# EAGLE design BleuettePi (EAGLE 6.4)
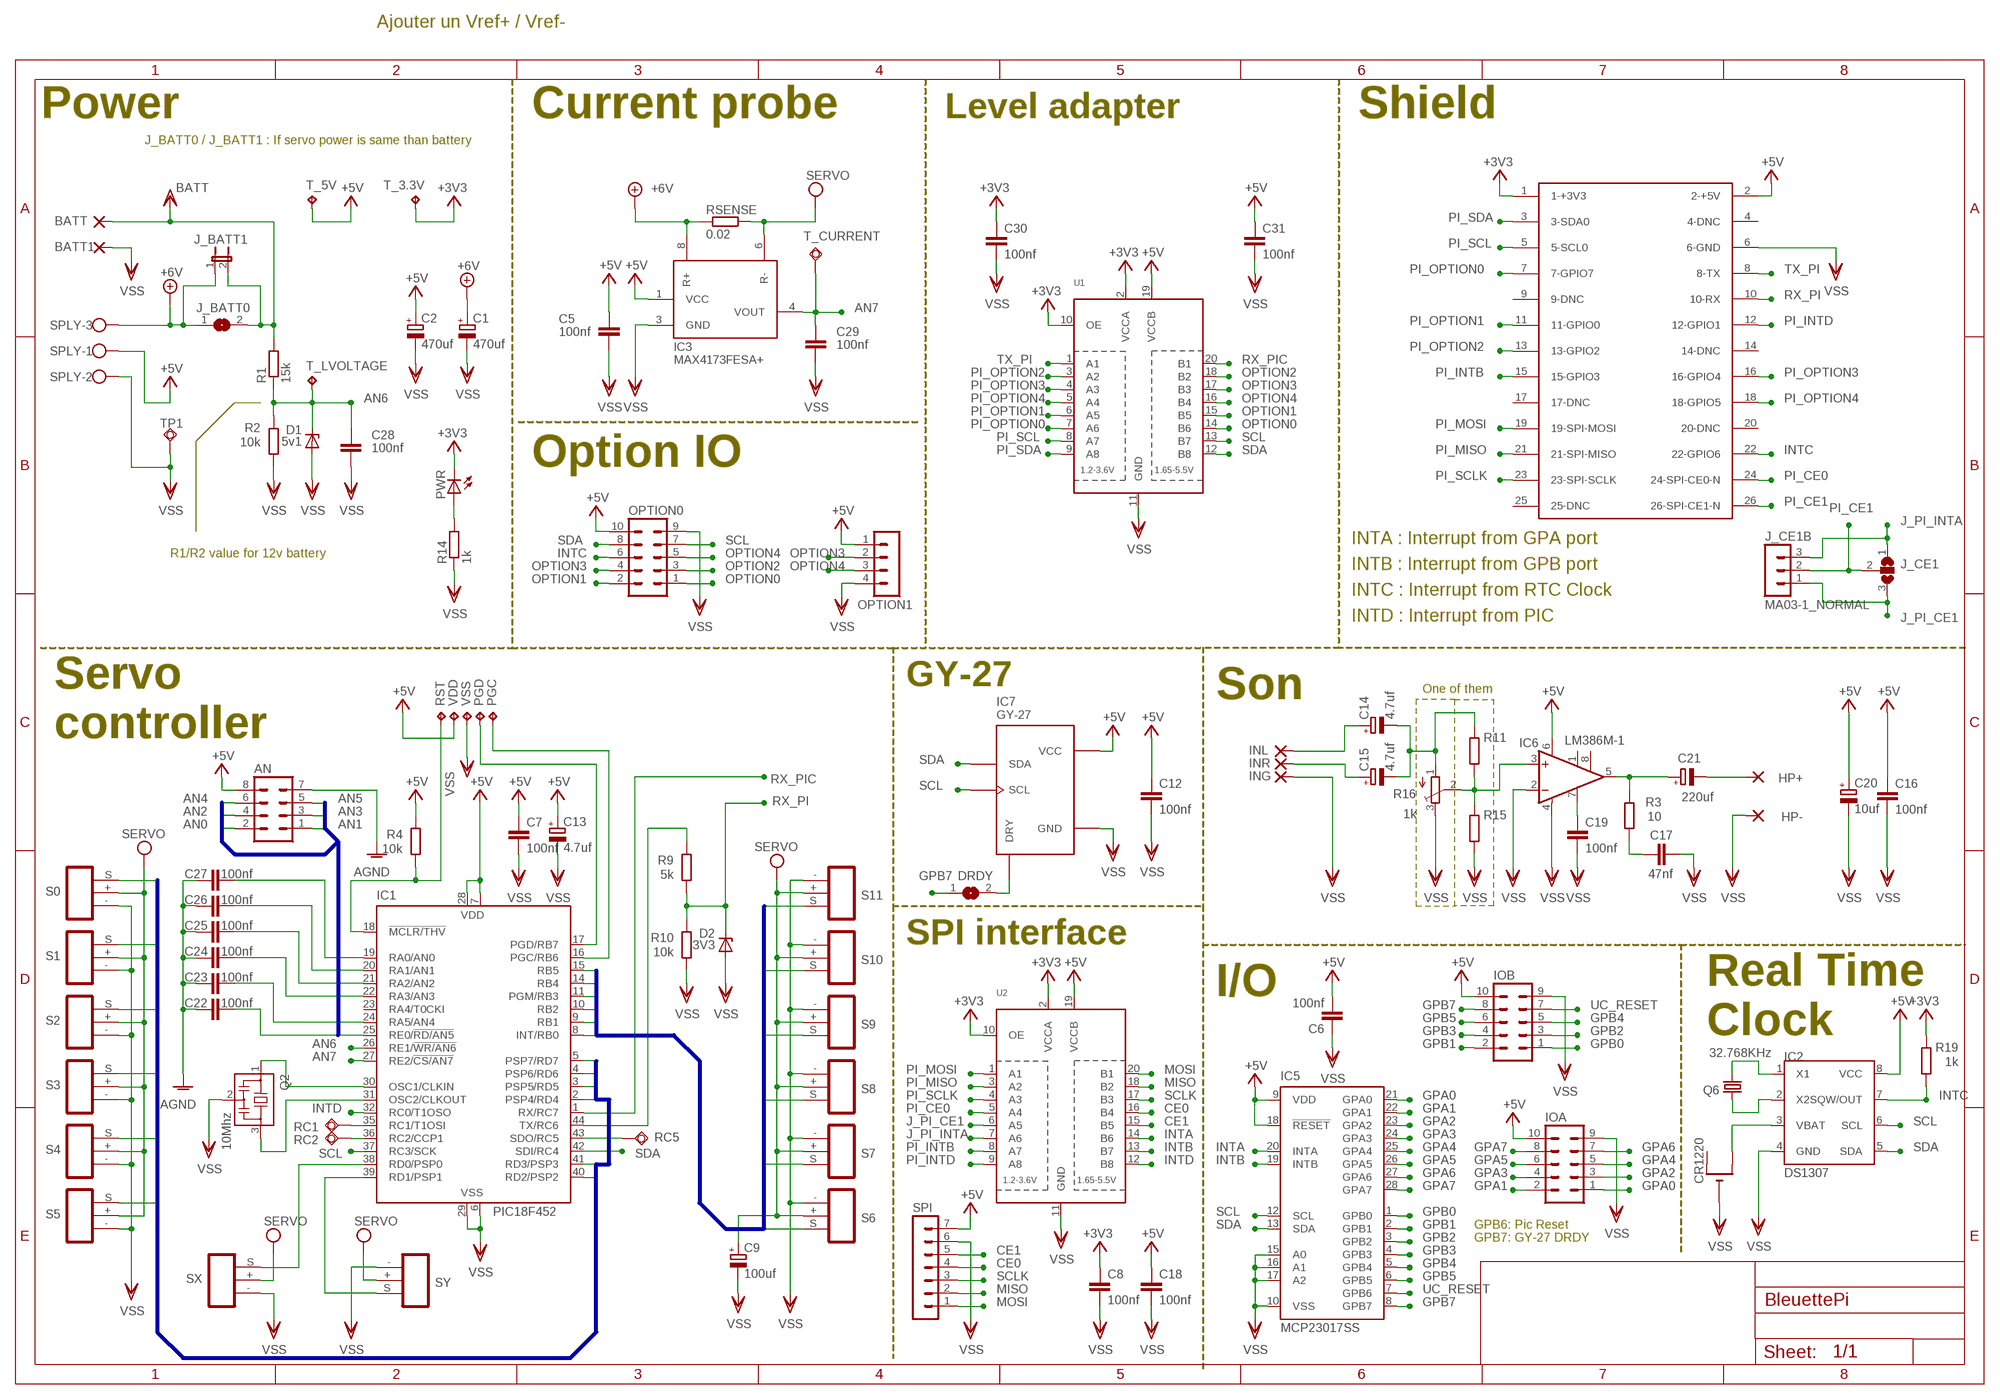
[diagram p0: schematic, sheet 1]

## Parts
AN  MA04-2  [MA04-2]
BATT  2,15/1,0  [2,15/1,0]
BATT1  2,15/1,0  [2,15/1,0]
C1  470uf  CPOL-EUF  [PANASONIC_F]
C2  470uf  CPOL-EUF  [PANASONIC_F]
C5  100nf  C-EUC0805  [C0805]
C6  100nf  C-EUC0805  [C0805]
C7  100nf  C-EUC0805  [C0805]
C8  100nf  C-EUC0805  [C0805]
C9  100uf  CPOL-EUD  [PANASONIC_D]
C12  100nf  C-EUC0805  [C0805]
C13  4.7uf  CPOL-EUCT3528  [CT3528]
C14  4.7uf  CPOL-EUCT3528  [CT3528]
C15  4.7uf  CPOL-EUCT3528  [CT3528]
C16  100nf  C-EUC0805  [C0805]
C17  47nf  C-EUC0805  [C0805]
C18  100nf  C-EUC0805  [C0805]
C19  100nf  C-EUC0805  [C0805]
C20  10uf  CPOL-EUCT3528  [CT3528]
C21  220uf  CPOL-EUD  [PANASONIC_D]
C22  100nf  C-EUC0805  [C0805]
C23  100nf  C-EUC0805  [C0805]
C24  100nf  C-EUC0805  [C0805]
C25  100nf  C-EUC0805  [C0805]
C26  100nf  C-EUC0805  [C0805]
C27  100nf  C-EUC0805  [C0805]
C28  100nf  C-EUC0805  [C0805]
C29  100nf  C-EUC0805  [C0805]
C30  100nf  C-EUC0805  [C0805]
C31  100nf  C-EUC0805  [C0805]
CR1220  CR1220THM  [CR1220-THM]
D1  5v1  ZENER-DIODESOT23  [SOT23]
D2  3V3  ZENER-DIODESOT23  [SOT23]
DRDY  SJ  [SJ]
HP+  2,15/1,0  [2,15/1,0]
HP-  2,15/1,0  [2,15/1,0]
IC1  PIC18F452  PIC16F877PT  [TQFP44]
IC2  DS1307  [SOIC-8]
IC3  MAX4173FESA+  MAX4173A  [SO08]
IC5  MCP23017SS  [SSOP28]
IC6  LM386M-1  [SO08]
IC7  GY-27  [GY-27]
ING  2,15/1,0  [2,15/1,0]
INL  2,15/1,0  [2,15/1,0]
INR  2,15/1,0  [2,15/1,0]
IOA  MA05-2  [MA05-2]
IOB  MA05-2  [MA05-2]
J_BATT0  SJ  [SJ]
J_BATT1  JP1E  [JP1]
J_CE1  SJ2W  [SJ_2]
J_CE1B  MA03-1_NORMAL  [MA03-1_NORMAL]
OPTION0  MA05-2  [MA05-2]
OPTION1  MA04-1  [MA04-1]
PGC  TPTP20R  [TP20R]
PGD  TPTP20R  [TP20R]
PWR  LEDCHIPLED_0805  [CHIPLED_0805]
Q2  10Mhz  CSTCR6M00G53Z  [CSTCR6M]
Q6  32.768KHz  CRYSTALTC26H  [TC26H]
R1  15k  R-EU_M0805  [M0805]
R2  10k  R-EU_M0805  [M0805]
R3  10  R-EU_M0805  [M0805]
R4  10k  R-EU_M0805  [M0805]
R9  5k  R-EU_M0805  [M0805]
R10  10k  R-EU_M0805  [M0805]
R11  R-EU_M0805  [M0805]
R14  1k  R-EU_M0805  [M0805]
R15  R-EU_M0805  [M0805]
R16  1k  TRIM_EU-3223J  [3223J]
R19  1k  R-EU_M0805  [M0805]
RC1  TPSQTP06SQ  [TP06SQ]
RC2  TPSQTP06SQ  [TP06SQ]
RC5  TPSQTP06SQ  [TP06SQ]
RSENSE  0.02  R-EU_R4527  [R4527]
RST  TPTP20R  [TP20R]
S0  CONN_SERVO  [CONN_SERVO]
S1  CONN_SERVO  [CONN_SERVO]
S2  CONN_SERVO  [CONN_SERVO]
S3  CONN_SERVO  [CONN_SERVO]
S4  CONN_SERVO  [CONN_SERVO]
S5  CONN_SERVO  [CONN_SERVO]
S6  CONN_SERVO  [CONN_SERVO]
S7  CONN_SERVO  [CONN_SERVO]
S8  CONN_SERVO  [CONN_SERVO]
S9  CONN_SERVO  [CONN_SERVO]
S10  CONN_SERVO  [CONN_SERVO]
S11  CONN_SERVO  [CONN_SERVO]
SPI  MA07-1  [MA07-1]
SPLY  W237-103  [W237-103]
SX  CONN_SERVO  [CONN_SERVO]
SY  CONN_SERVO  [CONN_SERVO]
T_3.3V  TPB1,27  [B1,27]
T_5V  TPB1,27  [B1,27]
T_CURRENT  TPSQPAD1-13  [P1-13]
T_LVOLTAGE  TPB1,27  [B1,27]
TP1  TPSQPAD1-13  [P1-13]
U1  TXB0108PWR  [TSSOP20]
U2  TXB0108PWR  [TSSOP20]
U$3  RASPBERRY-PILIGHT-HOLE  [RASPBERRY-PI-LIGHT-HOLE]
VDD  TPTP20R  [TP20R]
VSS  TPTP20R  [TP20R]

## Nets
+3V3: C8.1 C30.1 PWR.C R19.2 T_3.3V.TP U1.2(VCCA) U1.10(OE) U2.2(VCCA) U2.10(OE) U$3.1(1-+3V3)
+5V: AN.8 C2.+ C5.1 C6.2 C7.1 C12.1 C13.+ C16.1 C18.1 C20.+ C31.1 IC1.7(VDD) IC1.28(VDD) IC2.8(VCC) IC3.1(VCC) IC5.9(VDD) IC5.18(!RESET) IC6.6(VS) IC7.VCC IOA.10 IOB.10 OPTION0.10 OPTION1.1 R4.2 SPI.7 SPLY.1 T_5V.TP U1.19(VCCB) U2.19(VCCB) U$3.2(2-+5V) VDD.TP
+7V: C1.+ IC3.8(R+) J_BATT0.1 J_BATT1.1 RSENSE.1 SPLY.3 ; supply symbol labelled +6V
AGND: AN.7 C22.1 C23.1 C24.1 C25.1 C26.1 C27.1
AN0: AN.2 C27.2 IC1.19(RA0/AN0)
AN1: AN.1 C26.2 IC1.20(RA1/AN1)
AN2: AN.4 C25.2 IC1.21(RA2/AN2)
AN3: AN.3 C24.2 IC1.22(RA3/AN3)
AN4: AN.6 C23.2 IC1.24(RA5/AN4)
AN5: AN.5 C22.2 IC1.25(RE0/!RD/AN5)
AN6: C28.2 D1.3(C) IC1.26(RE1/!WR/AN6) R1.1 R2.2 T_LVOLTAGE.TP
AN7: C29.2 IC1.27(RE2/!CS/AN7) IC3.4(VOUT) T_CURRENT.TP
CE0: SPI.4 U2.16(B4)
CE1: SPI.5 U2.15(B5)
GPA0: IC5.21(GPA0) IOA.1
GPA1: IC5.22(GPA1) IOA.2
GPA2: IC5.23(GPA2) IOA.3
GPA3: IC5.24(GPA3) IOA.4
GPA4: IC5.25(GPA4) IOA.5
GPA5: IC5.26(GPA5) IOA.6
GPA6: IC5.27(GPA6) IOA.7
GPA7: IC5.28(GPA7) IOA.8
GPB0: IC5.1(GPB0) IOB.1
GPB1: IC5.2(GPB1) IOB.2
GPB2: IC5.3(GPB2) IOB.3
GPB3: IC5.4(GPB3) IOB.4
GPB4: IC5.5(GPB4) IOB.5
GPB5: IC5.6(GPB5) IOB.6
GPB7: DRDY.1 IC5.8(GPB7) IOB.8
INTA: IC5.20(INTA) U2.14(B6)
INTB: IC5.19(INTB) U2.13(B7)
INTC: IC2.7(SQW/OUT) OPTION0.6 R19.1 U$3.22(22-GPIO6)
INTD: IC1.32(RC0/T1OSO) U2.12(B8)
J_PI_CE1: J_CE1.3 J_CE1B.1 U2.6(A5)
J_PI_INTA: J_CE1.1 J_CE1B.3 U2.7(A6)
MISO: SPI.2 U2.18(B2)
MOSI: SPI.1 U2.20(B1)
N$1: IC1.31(OSC2/CLKOUT) Q2.3
N$2: IC1.30(OSC1/CLKIN) Q2.1
N$7: C14.- C15.- R11.2 R16.1(A)
N$8: C14.+ INL.1(P)
N$9: C21.- HP+.1(P)
N$19: IC1.38(RD0/PSP0) SX.S
N$22: IC1.17(PGD/RB7) PGD.TP
N$23: IC1.16(PGC/RB6) PGC.TP
N$24: IC1.39(RD1/PSP1) SY.S
N$33: IC2.1(X1) Q6.2
N$34: IC2.2(X2) Q6.1
N$36: DRDY.2 IC7.DRY
N$39: PWR.A R14.2
N$40: C15.+ INR.1(P)
N$41: IC6.3(+IN) R11.1 R15.2 R16.2(S)
N$42: C21.+ IC6.5(OUT) R3.2
N$43: C17.1 R3.1
N$47: C19.1 IC6.7(BYPASS)
N$58: CR1220.+2(+1) IC2.3(VBAT)
OPTION0: OPTION0.1 U1.14(B6)
OPTION1: OPTION0.2 U1.15(B5)
OPTION2: OPTION0.3 U1.18(B2)
OPTION3: OPTION0.4 OPTION1.2 U1.17(B3)
OPTION4: OPTION0.5 OPTION1.3 U1.16(B4)
PI_CE0: U2.5(A4) U$3.24(24-SPI-CE0-N)
PI_CE1: J_CE1.2 J_CE1B.2 U$3.26(26-SPI-CE1-N)
PI_INTB: U2.8(A7) U$3.15(15-GPIO3)
PI_INTD: U2.9(A8) U$3.12(12-GPIO1)
PI_MISO: U2.3(A2) U$3.21(21-SPI-MISO)
PI_MOSI: U2.1(A1) U$3.19(19-SPI-MOSI)
PI_OPTION0: U1.7(A6) U$3.7(7-GPIO7)
PI_OPTION1: U1.6(A5) U$3.11(11-GPIO0)
PI_OPTION2: U1.3(A2) U$3.13(13-GPIO2)
PI_OPTION3: U1.4(A3) U$3.16(16-GPIO4)
PI_OPTION4: U1.5(A4) U$3.18(18-GPIO5)
PI_SCL: U1.8(A7) U$3.5(5-SCL0)
PI_SCLK: U2.4(A3) U$3.23(23-SPI-SCLK)
PI_SDA: U1.9(A8) U$3.3(3-SDA0)
RC1: IC1.35(RC1/T1OSI) RC1.TP
RC2: IC1.36(RC2/CCP1) RC2.TP
RC5: IC1.43(SDO/RC5) RC5.TP
RX_PI: D2.3(C) R9.1 R10.2 U$3.10(10-RX)
RX_PIC: IC1.1(RX/RC7) U1.20(B1)
SCL: IC1.37(RC3/SCK) IC2.6(SCL) IC5.12(SCL) IC7.SCL OPTION0.7 U1.13(B7)
SCLK: SPI.3 U2.17(B3)
SDA: IC1.42(SDI/RC4) IC2.5(SDA) IC5.13(SDA) IC7.SDA OPTION0.8 U1.12(B8)
SS0: IC1.40(RD2/PSP2) S0.S
SS1: IC1.41(RD3/PSP3) S1.S
SS2: IC1.2(PSP4/RD4) S2.S
SS3: IC1.3(PSP5/RD5) S3.S
SS4: IC1.4(PSP6/RD6) S4.S
SS5: IC1.5(PSP7/RD7) S5.S
SS6: IC1.8(INT/RB0) S6.S
SS7: IC1.9(RB1) S7.S
SS8: IC1.10(RB2) S8.S
SS9: IC1.11(PGM/RB3) S9.S
SS10: IC1.14(RB4) S10.S
SS11: IC1.15(RB5) S11.S
TX_PI: U1.1(A1) U$3.8(8-TX)
TX_PIC: IC1.44(TX/RC6) R9.2
UC_RESET: IC1.18(!MCLR/THV) IC5.7(GPB6) IOB.7 R4.1 RST.TP
VDD: BATT.1(P) J_BATT0.2 J_BATT1.2 R1.2 ; supply symbol labelled BATT
VEE: C9.+ IC3.6(R-) RSENSE.2 S0.+ S1.+ S2.+ S3.+ S4.+ S5.+ S6.+ S7.+ S8.+ S9.+ S10.+ S11.+ SX.+ SY.+ ; supply symbol labelled SERVO
VSS: BATT1.1(P) C1.- C2.- C5.2 C6.1 C7.2 C8.2 C9.- C12.2 C13.- C16.2 C17.2 C18.2 C19.2 C20.- C28.1 C29.1 C30.2 C31.2 CR1220.- D1.1(A) D2.1(A) HP-.1(P) IC1.6(VSS) IC1.29(VSS) IC2.4(GND) IC3.3(GND) IC5.10(VSS) IC5.15(A0) IC5.16(A1) IC5.17(A2) IC6.2(-IN) IC6.4(GND) IC7.GND ING.1(P) IOA.9 IOB.9 OPTION0.9 OPTION1.4 Q2.2 R2.1 R10.1 R14.1 R15.1 R16.3(E) S0.- S1.- S2.- S3.- S4.- S5.- S6.- S7.- S8.- S9.- S10.- S11.- SPI.6 SPLY.2 SX.- SY.- TP1.TP U1.11(GND) U2.11(GND) U$3.6(6-GND) VSS.TP
Unconnected: CR1220.+1(+) IC1.23(RA4/T0CKI) IC6.1(GAIN) IC6.8(GAIN) U$3.4(4-DNC) U$3.9(9-DNC) U$3.14(14-DNC) U$3.17(17-DNC) U$3.20(20-DNC) U$3.25(25-DNC)

## Buses
SS[0..5]
SS[6..11]
AN[0..5]

## Notes on the sheet
- Ajouter un Vref+ / Vref-
- Power | Current probe | Level adapter | Shield
- J_BATT0 / J_BATT1 : If servo power is same than battery
- Option IO
- INTA : Interrupt from GPA port
- R1/R2 value for 12v battery
- INTB : Interrupt from GPB port
- INTC : Interrupt from RTC Clock
- INTD : Interrupt from PIC
- GY-27
- One of them
- Son
- Servo
  controller
- SPI interface
- I/O
- Real Time
  Clock
- GPB6: Pic Reset
- GPB7: GY-27 DRDY

## Library data of the parts
AN = con-lstb:MA04-2: PIN HEADER; OC_FARNELL: unknown; OC_NEWARK: unknown
BATT BATT1 HP+ HP- ING INL INR = wirepad:2,15/1,0: THROUGH-HOLE PAD
C1 C2 C9 C13-C15 C20 C21 = rcl:CPOL-EU: POLARIZED CAPACITOR, European symbol
C5-C8 C12 C16-C19 C22-C31 = rcl:C-EU: CAPACITOR, European symbol
CR1220 = adafruit:CR1220: CR1216/CR1220/CR1225 12mm 3V lithium coin cell Great for battery packup. Both SMT and THM holders. Note the THM package has the ground pads on both sides of the PCB so that the masks are the same - this reduces the cost
D1 D2 = diode:ZENER-DIODE: Z-Diode
DRDY J_BATT0 = jumper:SJ: SMD solder JUMPER
IC1 = microchip:PIC16F87*: MICROCONTROLLER; MF: MICROCHIP; MPN: PIC16F877-04/PQ; OC_FARNELL: 9761411; OC_NEWARK: 23C5094
IC2 = eagleParts:DS1307: I2C Serial RTC w/56 bytes battery backed RAM
IC3 = AWJLEagleLib:MAX4173: Maxim MAX4173 high side current monitor SOT363 pin 2 goes to GND
IC5 = adafruit:MCP23017: http://ww1.microchip.com/downloads/en/DeviceDoc/21952a.pdf Source: http://ww1.microchip.com/downloads/en/DeviceDoc/21952a.pdf
IC6 = linear:LM386?-*: Low Voltage Audio Power Amplifier Source: http://cache.national.com/ds/LM/LM386.pdf
IC7 = gy-27:GY-27
IOA IOB OPTION0 = con-lstb:MA05-2: PIN HEADER; OC_FARNELL: unknown; OC_NEWARK: unknown
J_BATT1 = jumper:JP1E: JUMPER
J_CE1 = jumper:SJ2W: SMD solder JUMPER
J_CE1B = con-lstb:MA03-1_NORMAL
OPTION1 = con-lstb:MA04-1: PIN HEADER; OC_FARNELL: unknown; OC_NEWARK: unknown
PGC PGD RST T_3.3V T_5V T_LVOLTAGE VDD VSS = testpad:TP: Test pad
PWR = led:LED: LED OSRAM: - CHIPLED LG R971, LG N971, LY N971, LG Q971, LY Q971, LO R971, LY R971 LH N974, LH R974 LS Q976, LO Q976, LY Q976 LO Q996 - Hyper CHIPLED LW Q18S LB Q993, LB Q99A, LB R99A - SideLED LS A670, LO A670, LY A670, LG A670, LP A670 LB A673, LV A673, LT A673, LW A673 LH A674 LY A675 LS A676, LA A676, LO A676, LY A676, LW A676 LS A679, LY A679, LG A679 - Hyper Micro SIDELED® LS Y876, LA Y876, LO Y876, LY Y876 LT Y87S - SmartLED LW L88C, LW L88S LB L89C, LB L89S, LG L890 LS L89K, LO L89K, LY L89K LS L896, LA L896, LO L896, LY L896 - TOPLED LS T670, LO T670, LY T670, LG T670, LP T670 LSG T670, LSP T670, LSY T670, LOP T670, LYG T670 LG T671, LOG T671, LSG T671 LB T673, LV T673, LT T673, LW T673 LH T674 LS T676, LA T676, LO T676, LY T676, LB T676, LH T676, LSB T676, LW T676 LB T67C, LV T67C, LT T67C, LS T67K, LO T67K, LY T67K, LW E67C LS E67B, LA E67B, LO E67B, LY E67B, LB E67C, LV E67C, LT E67C LW T67C LS T679, LY T679, LG T679 LS T770, LO T770, LY T770, LG T770, LP T770 LB T773, LV T773, LT T773, LW T773 LH T774 LS E675, LA E675, LY E675, LS T675 LS T776, LA T776, LO T776, LY T776, LB T776 LHGB T686 LT T68C, LB T68C - Hyper Mini TOPLED® LB M676 - Mini TOPLED Santana® LG M470 LS M47K, LO M47K, LY M47K Source: http://www.osram.convergy.de LUXEON: - LUMILED® LXK2-PW12-R00, LXK2-PW12-S00, LXK2-PW14-U00, LXK2-PW14-V00 LXK2-PM12-R00, LXK2-PM12-S00, LXK2-PM14-U00 LXK2-PE12-Q00, LXK2-PE12-R00, LXK2-PE12-S00, LXK2-PE14-T00, LXK2-PE14-U00 LXK2-PB12-K00, LXK2-PB12-L00, LXK2-PB12-M00, LXK2-PB14-N00, LXK2-PB14-P00, LXK2-PB14-Q00 LXK2-PR12-L00, LXK2-PR12-M00, LXK2-PR14-Q00, LXK2-PR14-R00 LXK2-PD12-Q00, LXK2-PD12-R00, LXK2-PD12-S00 LXK2-PH12-R00, LXK2-PH12-S00 LXK2-PL12-P00, LXK2-PL12-Q00, LXK2-PL12-R00 Source: www.luxeon.com KINGBRIGHT: KA-3528ASYC Source: www.kingbright.com
Q2 = murata-filter:CSTCR: Resonator Source: murata.co.jp; MPN: CSTCR6M00G53-R0; OC_FARNELL: 1170434; OC_NEWARK: 25M8759
Q6 = crystal:CRYSTAL: CRYSTAL; OC_FARNELL: unknown; OC_NEWARK: unknown
R1-R4 R9-R11 R14 R15 R19 RSENSE = rcl:R-EU_: RESISTOR, European symbol
R16 = pot:TRIM_EU-: POTENTIOMETER
RC1 RC2 RC5 T_CURRENT TP1 = testpad:TPSQ: Test pad
S0 S1-S11 SX SY = bleuette:CONN_SERVO
SPI = con-lstb:MA07-1: PIN HEADER; OC_FARNELL: unknown; OC_NEWARK: unknown
SPLY = con-wago-500:W237-103: WAGO SCREW CLAMP; MPN: 237-103; OC_FARNELL: unknown; OC_NEWARK: 18M7116
U1 U2 = adafruit:TXB0108PWR: 8-Bit Bi-Directional Level Shifter 1.2V-3.6V (VCCA) to 1.65V-5.5V (VCCB) bi-directional level shifter with auto direction sensing. Max data rate - VCCA 1.8V: 20Mbps (50ns), VCCA 3.3V: 100Mbps (10ns) Digikey: 296-21527-1-ND
U$3 = RaspberryPi:RASPBERRY-PI: Raspberry Pi Board <http://www.raspberrypi.org/> Jacques Lagnel V1.0 (beta) 2012 Board dimension: Forum 3D model <http://www.raspberrypi.org/forum/general-discussion/mechanical-profile-3d-models?value=3d%20model&type=1&include=1&search=1&ret=all> The GPIO Connector (P1): http://elinux.org/RPi_Low-level_peripherals

## Board
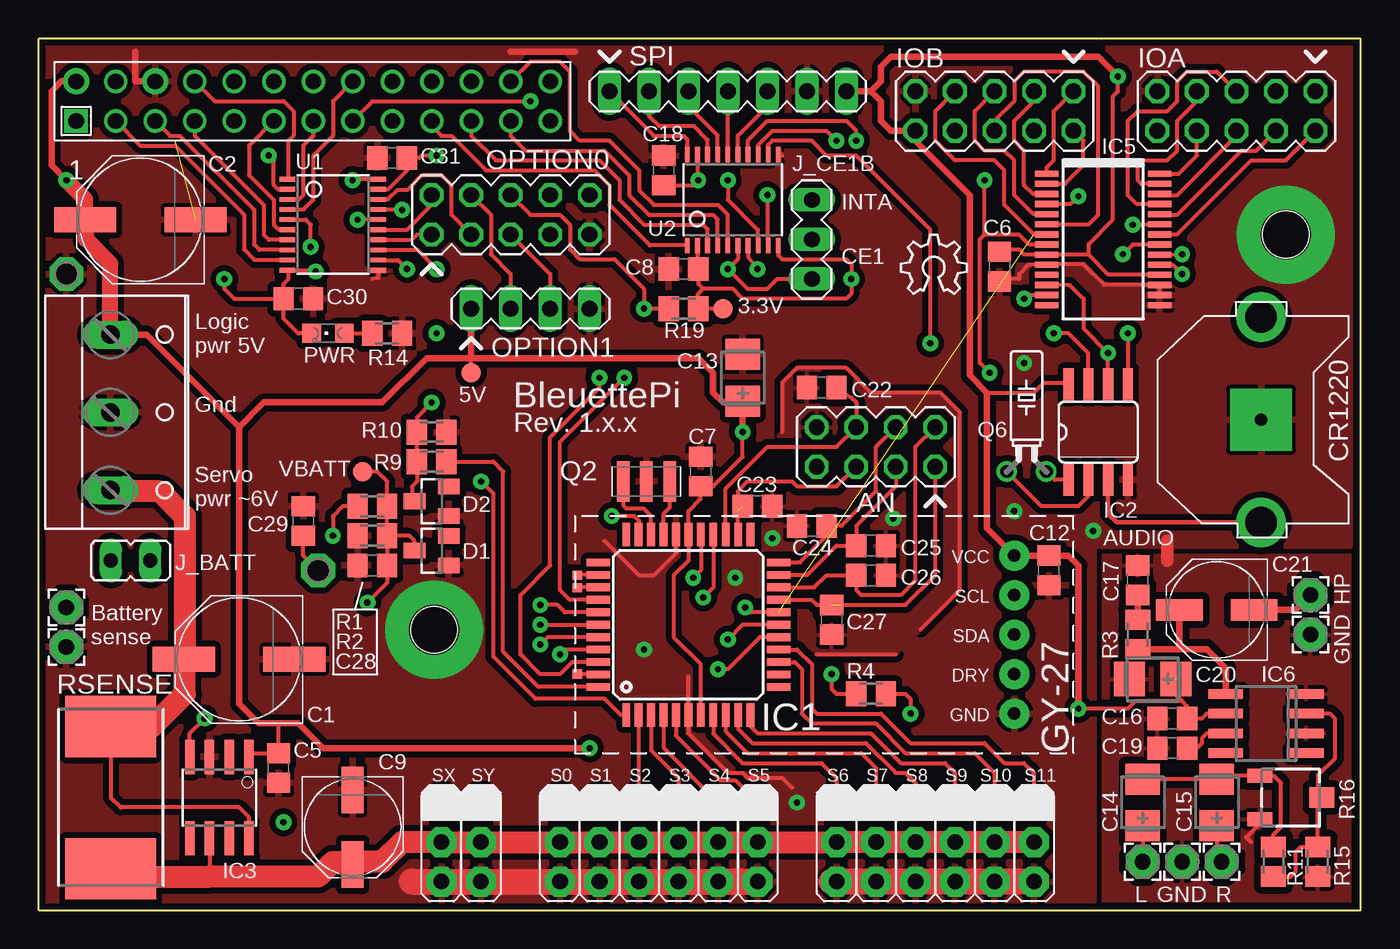
[diagram p1: board, top side]
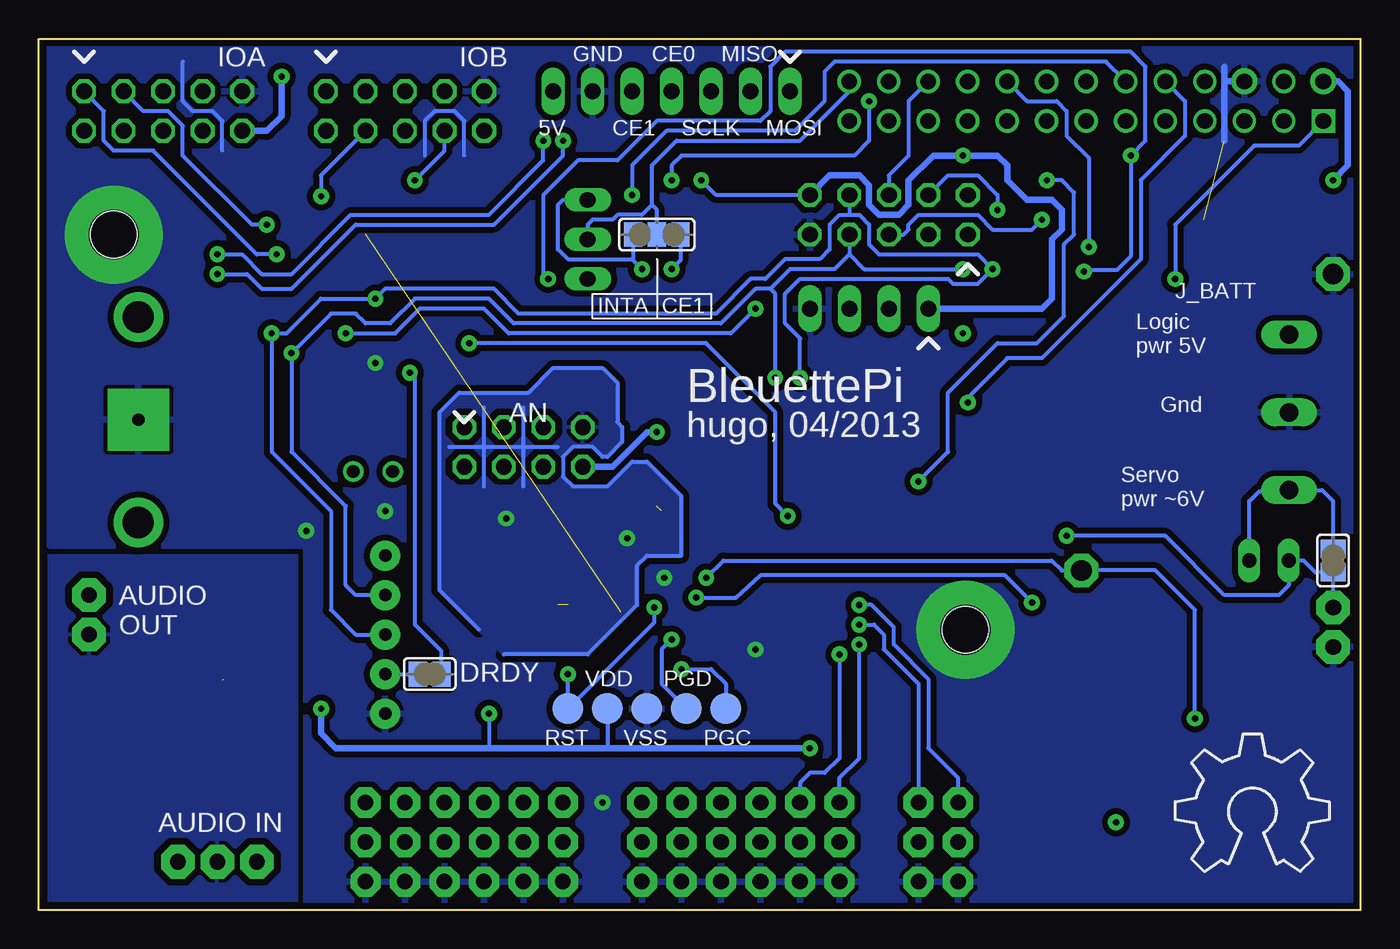
[diagram p2: board, bottom side, seen from below]

Size 85 x 56 mm. Coordinates in mm from the lower left corner, seen from the top.
Copper layers (1*16): Top 0.035mm / dielectric 1.5mm / Bottom 0.035mm
Design rules "Fusion_eagle_rule_v1.1": minimum track width 6mil, minimum drill 12mil, track to track 6mil, track to pad 6mil, pad to pad 6mil, via to via 6mil, smd to smd 0mil, copper to edge 10mil, drill to drill 10mil, minimum pad ring 10mil, minimum via ring 6mil, stop-mask expansion 2mil, vias tented up to drill 100mil, thermal gap 10mil

### Footprints (pad centres in the part's own frame; a part is rotated, then mirrored left to right if it is on the bottom)
MA04-2 = drill 1.016 octagon: 1 -3.81,-1.27; 2 -3.81,1.27; 3 -1.27,-1.27; 4 -1.27,1.27; 5 1.27,-1.27; 6 1.27,1.27; 7 3.81,-1.27; 8 3.81,1.27
2,15/1,0 = drill 1.016 pad 2.159 octagon: 1 0,0
PANASONIC_F = smd 4 x 1.6: + 3.55,0; - -3.55,0
C0805 = smd 1.3 x 1.5: 1 -0.95,0; 2 0.95,0
PANASONIC_D = smd 3 x 1.4: + 2.4,0; - -2.4,0
CT3528 = smd 2 x 2.2: + -1.5,0; - 1.5,0
CR1220-THM = drill 2 pad 3.175: +1 -6.604,0; +2 6.604,0 | drill 0.8 pad 3.962 square: - 0,0
SOT23 = smd 1 x 1.4: 1 -0.95,-1.1; 2 0.95,-1.1; 3 0,1.1
SJ = smd 1.168 x 1.6: 1 -0.762,0; 2 0.762,0
TQFP44 = smd 1.5 x 0.5: 1 -5.8,4; 2 -5.8,3.2; 3 -5.8,2.4; 4 -5.8,1.6; 5 -5.8,0.8; 6 -5.8,0; 7 -5.8,-0.8; 8 -5.8,-1.6; 9 -5.8,-2.4; 10 -5.8,-3.2; 11 -5.8,-4; 23 5.8,-4; 24 5.8,-3.2; 25 5.8,-2.4; 26 5.8,-1.6; 27 5.8,-0.8; 28 5.8,0; 29 5.8,0.8; 30 5.8,1.6; 31 5.8,2.4; 32 5.8,3.2; 33 5.8,4 | smd 0.5 x 1.5: 12 -4,-5.8; 13 -3.2,-5.8; 14 -2.4,-5.8; 15 -1.6,-5.8; 16 -0.8,-5.8; 17 0,-5.8; 18 0.8,-5.8; 19 1.6,-5.8; 20 2.4,-5.8; 21 3.2,-5.8; 22 4,-5.8; 34 4,5.8; 35 3.2,5.8; 36 2.4,5.8; 37 1.6,5.8; 38 0.8,5.8; 39 0,5.8; 40 -0.8,5.8; 41 -1.6,5.8; 42 -2.4,5.8; 43 -3.2,5.8; 44 -4,5.8
SOIC-8 = smd 2.032 x 0.66: 1 -3.073,1.27; 2 -3.073,0; 3 -3.073,-1.27; 4 -3.073,-2.54; 5 3.073,-2.54; 6 3.073,-1.27; 7 3.073,0; 8 3.073,1.27
SO08 = smd 0.61 x 2.21: 1 -1.905,-2.616; 2 -0.635,-2.616; 3 0.635,-2.616; 4 1.905,-2.616; 5 1.905,2.616; 6 0.635,2.616; 7 -0.635,2.616; 8 -1.905,2.616
SSOP28 = smd 0.4 x 1.5: 1 -4.225,-3.625; 2 -3.575,-3.625; 3 -2.925,-3.625; 4 -2.275,-3.625; 5 -1.625,-3.625; 6 -0.975,-3.625; 7 -0.325,-3.625; 8 0.325,-3.625; 9 0.975,-3.625; 10 1.625,-3.625; 11 2.275,-3.625; 12 2.925,-3.625; 13 3.575,-3.625; 14 4.225,-3.625; 15 4.225,3.625; 16 3.575,3.625; 17 2.925,3.625; 18 2.275,3.625; 19 1.625,3.625; 20 0.975,3.625; 21 0.325,3.625; 22 -0.325,3.625; 23 -0.975,3.625; 24 -1.625,3.625; 25 -2.275,3.625; 26 -2.925,3.625; 27 -3.575,3.625; 28 -4.225,3.625
SO08' = smd 0.6 x 2.2: 1 -1.905,-2.6; 2 -0.635,-2.6; 3 0.635,-2.6; 4 1.905,-2.6; 5 1.905,2.6; 6 0.635,2.6; 7 -0.635,2.6; 8 -1.905,2.6
GY-27 = drill 0.8 pad 1.93: DRY 3.81,10.16; GND 3.81,12.7; SCL 3.81,5.08; SDA 3.81,7.62; VCC 3.81,2.54
MA05-2 = drill 1.016 octagon: 1 -5.08,-1.27; 2 -5.08,1.27; 3 -2.54,-1.27; 4 -2.54,1.27; 5 0,-1.27; 6 0,1.27; 7 2.54,-1.27; 8 2.54,1.27; 9 5.08,-1.27; 10 5.08,1.27
JP1 = drill 0.914 long: 1 0,-1.27; 2 0,1.27
SJ_2 = smd 1.168 x 1.6: 1 -1.524,0; 2 0,0; 3 1.524,0
MA03-1_NORMAL = drill 1.016 long: 1 -3.81,0; 2 -1.27,0; 3 1.27,0
MA04-1 = drill 1.016 long: 1 -3.81,0; 2 -1.27,0; 3 1.27,0; 4 3.81,0
TP20R = smd 2 x 2: TP 0,0
CHIPLED_0805 = smd 1.2 x 1.2: A 0,-1.05; C 0,1.05
CSTCR6M = smd 0.8 x 2.6: 1 -1.5,0; 2 0,0; 3 1.5,0
TC26H = drill 0.813: 1 -1.27,0; 2 1.27,0
M0805 = smd 1.3 x 1.6: 1 -0.95,0; 2 0.95,0
3223J = smd 1.6 x 0.9: 1 -2,1.4; 3 -2,-1.4 | smd 1.6 x 1.3: 2 2,0
TP06SQ = smd 0.6 x 0.6: TP 0,0
R4527 = smd 3.94 x 5.84: 1 -4.575,0; 2 4.575,0
CONN_SERVO = drill 1 pad 1.93 octagon: + 0,0; - 2.54,0; S -2.54,0
MA07-1 = drill 1.016 long: 1 -7.62,0; 2 -5.08,0; 3 -2.54,0; 4 0,0; 5 2.54,0; 6 5.08,0; 7 7.62,0
W237-103 = drill 1.194 long: 1 -5,-1.29; 2 0,-1.29; 3 5,-1.29
B1,27 = smd 1.27 x 1.27: TP 0,0
P1-13 = drill 1.321 pad 2.159 octagon: TP 0,0
TSSOP20 = smd 0.305 x 0.991: 1 -2.925,-2.918; 2 -2.275,-2.918; 3 -1.625,-2.918; 4 -0.975,-2.918; 5 -0.325,-2.918; 6 0.325,-2.918; 7 0.975,-2.918; 8 1.625,-2.918; 9 2.275,-2.918; 10 2.925,-2.918; 11 2.925,2.918; 12 2.275,2.918; 13 1.625,2.918; 14 0.975,2.918; 15 0.325,2.918; 16 -0.325,2.918; 17 -0.975,2.918; 18 -1.625,2.918; 19 -2.275,2.918; 20 -2.925,2.918
RASPBERRY-PI-LIGHT-HOLE = drill 1 square: 1 -39.37,22.86 | drill 1 pad 1.676: 2 -39.37,25.4; 6 -34.29,25.4 | drill 1: 3 -36.83,22.86; 4 -36.83,25.4; 5 -34.29,22.86; 7 -31.75,22.86; 8 -31.75,25.4; 9 -29.21,22.86; 10 -29.21,25.4; 11 -26.67,22.86; 12 -26.67,25.4; 13 -24.13,22.86; 14 -24.13,25.4; 15 -21.59,22.86; 16 -21.59,25.4; 17 -19.05,22.86; 18 -19.05,25.4; 19 -16.51,22.86; 20 -16.51,25.4; 21 -13.97,22.86; 22 -13.97,25.4; 23 -11.43,22.86; 24 -11.43,25.4; 25 -8.89,22.86; 26 -8.89,25.4 | hole 3: -16.351,-9.842; 38.417,15.557

### Placement (x,y rotation side)
AN  53.84,29.77 180 top
BATT  1.77,19.45 0 top
BATT1  1.77,16.91 0 top
C1  12.88,16.12 180 top
C2  6.53,44.38 180 top
C5  15.42,9.13 270 top
C6  61.77,41.36 90 top
C7  42.56,28.18 90 top
C8  41.45,41.2 180 top
C9  20.18,5.32 270 top
C12  64.95,21.83 270 top
C13  45.26,34.21 90 top
C14  70.98,6.91 90 top
C15  75.74,6.91 90 top
C16  72.89,12.31 180 top
C17  70.66,21.2 90 top
C18  40.18,47.55 90 top
C19  72.89,10.4 180 top
C20  71.62,14.85 180 top
C21  75.74,19.29 180 top
C22  50.34,33.58 0 top
C23  46.22,25.96 180 top
C24  49.71,24.69 0 top
C25  53.52,23.42 180 top
C26  53.52,21.51 180 top
C27  50.98,18.66 90 top
C28  21.45,22.15 0 top
C29  17.01,25.01 270 top
C30  16.69,39.29 0 top
C31  22.72,48.34 180 top
CR1220  78.6,31.52 270 top
D1  25.26,23.1 90 top
D2  25.26,26.28 90 top
DRDY  59.87,15.16 180 bottom
HP+  81.78,20.24 0 top
HP-  81.78,17.7 0 top
IC1  41.77,18.34 90 top
IC2  67.49,30.72 90 top
IC3  11.61,7.23 180 top
IC5  68.44,43.1 270 top
IC6  LM386M-1  [SO08']  78.92,11.99 90 top
IC7  66.53,25.32 180 top
ING  73.52,3.1 0 top
INL  70.98,3.1 0 top
INR  76.06,3.1 0 top
IOA  77.01,51.36 180 top
IOB  61.46,51.36 180 top
J_BATT0  1.77,22.47 270 bottom
J_BATT1  5.89,22.47 90 top
J_CE1  45.26,43.42 0 bottom
J_CE1B  49.71,44.38 90 top
OPTION0  30.34,44.69 0 top
OPTION1  31.61,38.66 0 top
PGC  40.82,12.94 90 bottom
PGD  43.36,12.94 90 bottom
PWR  18.59,37.07 90 top
Q2  39.07,27.55 180 top
Q6  63.52,28.18 0 top
R1  21.45,25.96 180 top
R2  21.45,24.05 0 top
R3  70.66,17.7 270 top
R4  53.52,13.89 0 top
R9  25.26,28.82 0 top
R10  25.26,30.72 180 top
R11  79.39,3.1 90 top
R14  22.4,37.07 180 top
R15  82.25,3.1 90 top
R16  80.5,7.23 0 top
R19  41.45,38.66 0 top
RC1  34.63,21.51 180 top
RC2  34.63,20.72 180 top
RC5  34.63,15.16 0 top
RSENSE  4.62,7.23 270 top
RST  50.98,12.94 90 bottom
S0  33.52,4.37 270 top
S1  36.06,4.37 270 top
S2  38.6,4.37 270 top
S3  41.14,4.37 270 top
S4  43.68,4.37 270 top
S5  46.22,4.37 270 top
S6  51.3,4.37 270 top
S7  53.84,4.37 270 top
S8  56.38,4.37 270 top
S9  58.92,4.37 270 top
S10  61.46,4.37 270 top
S11  64,4.37 270 top
SPI  44.31,52.63 0 top
SPLY  5.89,31.99 270 top
SX  25.9,4.37 270 top
SY  28.44,4.37 270 top
T_3.3V  43.99,38.66 0 top
T_5V  27.8,34.53 0 top
T_CURRENT  17.96,21.83 0 top
T_LVOLTAGE  20.82,28.18 0 top
TP1  1.77,40.88 0 top
U1  18.91,44.06 270 top
U2  44.63,45.64 0 top
U$2  [OSHW_8X350_NOTEXT]  11.93,2.46 0 bottom
U$3  41.77,27.86 0 top
U$5  [OSHW_6X150_NOTEXT]  55.42,39.61 0 top
VDD  48.44,12.94 90 bottom
VSS  45.9,12.94 90 bottom

### Tracks (layer width: path | path; a pad name or v marks a point on that pad's centre or on a via)
+3V3  (via drill 0.41 pad 1.02)
  Top 0.254: 15.42,39.93 C30.1 | U1.2 15.37,46.33 15.1,46.6 15.1,48.18 v14.78,48.5 | U2.10 47.55,42.08 47.8,41.83 51.93,41.83 52.25,41.52 v52.25,40.56 52.25,39.61 51.93,39.29 45.26,39.29 44.63,39.93 42.72,39.93 | U2.2 42.35,41.25 C8.1 42.41,40.25 42.72,39.93 | 42.72,39.93 42.4,39.61 R19.2 T_3.3V.TP | v11.93,40.56 11.93,39.93 12.56,39.29 C30.1 | PWR.C 16.69,37.07 15.74,38.02 C30.1 | v17.8,41.04 17.71,41.13 U1.10 16.05,41.07 16.05,40.56 15.74,40.25 C30.1
  Bottom 0.254: U$3.1 3.99,49.14 6.85,49.14 11.93,44.06 v11.93,40.56 | v17.8,41.04 17.71,41.13 15.68,41.13 14.78,42.02 v14.78,48.5 13.83,49.45 13.83,54.22 14.78,55.17 37.01,55.17 37.96,54.22 37.96,51.36 38.6,50.72 45.26,50.72 47.8,48.18 50.34,48.18 52.57,45.96 52.57,40.88 v52.25,40.56
+5V  (via drill 0.41 pad 1.02)  (2 unrouted)
  Top 0.254: v45.26,30.72 45.26,29.13 43.36,27.23 42.25,27.23 C7.1 42.56,26.44 41.77,25.64 IC1.28 41.77,22.47 40.82,21.51 40.82,17.55 42.57,15.79 IC1.7 | IC3.1 13.83,10.08 C5.1 15.42,11.99 | 67.51,42.13 68.76,40.88 72.01,40.88 IC5.18 | IC6.6 75.11,12.62 74.79,12.31 C16.1 73.84,13.1 73.52,13.42 | 73.52,13.42 70.5,13.42 70.03,12.94 v66.85,12.94 | 73.52,13.42 73.2,13.74 73.2,14.82 | 64.94,22.47 C12.1 | C18.1 42.09,46.6 v42.41,46.91 42.35,46.97 U2.19 | v25.58,48.5 24.63,48.5 24.47,48.34 C31.1 23.67,47.55 22.46,46.33 U1.19 | C6.2 61.78,42.47 63.04,42.47 63.36,42.15 64.79,42.15 IC5.9 67.51,42.13 | 67.51,42.13 67.51,42.81 69.08,44.38 69.08,52.31 69.39,52.63 v69.39,53.58 | 60.98,33.26 64,33.26 64.63,33.9 66.12,33.9 IC2.8 | T_5V.TP 27.8,35.48 | R4.2 55.74,13.89 56.06,13.58 v56.06,12.62
  Top 0.406: v35.42,10.4 18.28,10.4 16.69,11.99 15.42,11.99 14.15,11.99 12.88,13.26 12.88,31.04 | v1.77,46.91 0.81,47.87 0.81,52.63 1.45,53.27 U$3.2 | 27.8,35.48 24.94,35.48 22.09,32.63 14.47,32.63 12.88,31.04 | 27.8,35.48 42.41,35.48 43.36,34.53 43.36,33.26 43.99,32.63 45.81,32.63 C13.+ v45.26,30.72 | OPTION1.1 27.8,35.48 | 53.52,52.63 54.15,51.99 54.15,50.72 54.79,50.09 IOB.10 56.38,49.45 59.87,45.96 59.87,34.37 60.98,33.26 60.98,24.53 IC7.VCC C12.1 66.22,22.78 66.85,22.15 v66.85,12.94 | SPI.7 53.52,52.63 | 53.52,52.63 54.15,53.27 54.15,54.22 54.79,54.85 68.12,54.85 v69.39,53.58 | SPLY.1 6.93,36.99 12.88,31.04
  Top 1.016: v1.77,46.91 2.98,45.7 C2.+ 3.04,44.32 3.04,43.1 4.6,41.54 SPLY.1
  Bottom 0.254: VDD.TP 48.44,10.4 | OPTION0.10 41.45,45.96 v42.41,46.91 | v56.06,12.62 56.06,10.4
  Bottom 0.406: v66.85,12.94 66.85,11.35 65.9,10.4 56.06,10.4 48.44,10.4 v35.42,10.4 | v1.77,46.91 0.81,47.87 0.81,52.63 1.45,53.27 U$3.2 | v69.39,53.58 69.39,51.04 70.34,50.09 IOA.10 | OPTION1.1 20.5,38.66 19.86,39.29 19.86,43.1 19.23,43.74 19.23,45.01 19.86,45.64 21.45,45.64 22.72,46.91 22.72,47.87 23.36,48.5 v25.58,48.5 27.48,48.5 29.07,46.91 29.07,45.33 29.71,44.69 30.98,44.69 31.61,45.33 31.61,46.6 32.25,47.23 34.15,47.23 OPTION0.10 | v45.26,30.72 45.9,30.72 48.12,28.5 AN.8
+7V
  Top 0.254: RSENSE.1 4.62,7.23 5.26,6.59 12.88,6.59 13.51,5.96 IC3.8
  Top 1.422: C1.+ 8.75,16.12 | 9.39,16.38 9.39,25.32 7.8,26.91 4.62,26.91 4.62,26.97 SPLY.3 | 9.39,16.38 C1.+ | C1.+ 9.39,16.12 | RSENSE.1 7.29,11.8 9.39,13.89 9.39,16.38
  Bottom 0.254: J_BATT0.1 1.77,26.28 2.48,26.99 SPLY.3 4.68,26.91 6.53,26.91 7.16,26.28 J_BATT1.1
AGND  (via drill 0.41 pad 1.02)
  Top 0.254: 50.03,16.43 55.11,16.43 | 47.8,30.72 47.8,33.9 48.76,34.85 51.93,34.85 53.52,33.26 57.96,33.26 59.23,31.99 59.23,20.56 56.69,18.02
  Bottom 0.254: 55.11,16.43 49.71,16.43 46.53,19.61 46.53,22.15 45.9,22.78 43.68,22.78 43.68,26.59 45.9,28.82 46.85,28.82 48.44,27.23 50.66,27.23 51.3,27.86 51.3,29.13 50.66,29.77 49.39,29.77 48.76,29.13 48.44,29.13 47.49,30.09 47.49,31.04 47.8,31.36 47.8,33.9 48.76,34.85 51.93,34.85 53.52,33.26 57.96,33.26 59.23,31.99 59.23,20.56 56.69,18.02 | 58.6,29.77 51.61,29.77 | 56.38,27.23 56.38,32.31 | 53.84,27.23 53.84,32.31
  other vias: 47.17,23.9 54.95,25.17
  pour Top (isolate 0.457): 50.03,16.43 55.11,16.43 59.23,20.56 59.23,31.99 57.96,33.26 53.52,33.26 51.93,34.85 48.76,34.85 47.8,33.9 47.8,30.72 43.68,26.59 43.68,22.78 46.22,22.78 46.22,19.93 48.76,17.39 49.07,17.39
  pour Bottom (isolate 0.457): 49.71,16.43 55.11,16.43 59.23,20.56 59.23,31.99 57.96,33.26 53.52,33.26 51.93,34.85 48.76,34.85 47.8,33.9 47.8,31.36 47.49,31.04 47.49,30.09 48.44,29.13 48.76,29.13 49.39,29.77 50.66,29.77 51.3,29.13 51.3,27.86 50.66,27.23 48.44,27.23 46.85,28.82 45.9,28.82 43.68,26.59 43.68,22.78 45.9,22.78 46.53,22.15 46.53,19.61
AN0  (1 unrouted)
  Top 0.254: AN.2 57.65,21.51 55.74,19.61 51.61,19.61 | IC1.19 49.7,19.94 50.03,19.61 C27.2
AN1
  Top 0.254: AN.1 56.38,29.77 56.38,21.2 55.42,20.24 52.88,20.24 52.57,20.56 52.57,20.88 C26.2 50.66,21.51 49.85,20.74 IC1.20
AN2
  Top 0.254: IC1.21 49.42,21.54 51.3,23.42 C25.2 52.57,24.37 52.57,24.69 55.11,27.23 AN.4
AN3
  Top 0.254: AN.3 53.84,29.77 53.84,26.91 51.61,24.69 C24.2 50.66,24.37 | IC1.22 48.95,22.34 50.66,24.05 50.66,24.37 | C24.2 50.66,24.37
AN4  (1 unrouted)
  Top 0.254: IC1.24 44.97,25.67 | C23.2 44.95,26.59 44.95,26.91 45.58,27.55 48.44,27.55 48.76,27.23 51.3,27.23 AN.6
AN5
  Top 0.254: IC1.25 44.17,27.09 46.85,29.77 51.3,29.77 AN.5 52.56,32.63 52.25,32.95 C22.2
AN6  (via drill 0.41 pad 1.02)  (1 unrouted)
  Top 0.254: IC1.26 43.37,20.73 v42.72,20.09 | R2.2 22.4,23.1 C28.2 22.4,21.04 v21.13,19.77 | R2.2 R1.1 | R1.1 | R1.1 22.4,27.55 21.77,28.18 T_LVOLTAGE.TP | 24.31,23.1 D1.3 24.16,23.73 23.83,24.05 R2.2
  Bottom 0.254: v42.72,20.09 40.18,20.09 38.6,21.51 22.88,21.51 v21.13,19.77
AN7  (via drill 0.41 pad 1.02)
  Top 0.254: IC1.27 42.57,21.84 v42.09,21.36 | IC3.4 9.7,11.35 v10.66,12.31 | T_CURRENT.TP 17.01,22.78 C29.2
  Bottom 0.254: v42.09,21.36 40.98,22.47 19.86,22.47 19.23,21.83 T_CURRENT.TP 13.2,21.83 10.66,19.29 v10.66,12.31
CE0
  Top 0.254: U2.16 SPI.4
CE1
  Top 0.254: SPI.5 46.85,51.68 44.95,49.78 U2.15
GPA0  (via drill 0.41 pad 1.02)
  Top 0.254: IC5.21 70.34,42.78 v69.71,42.15
  Bottom 0.254: v69.71,42.15 70.98,42.15 77.65,48.82 80.19,48.82 80.82,49.45 80.82,51.36 IOA.1
GPA1
  Top 0.254: IC5.22 73.21,43.43 77.97,48.18 80.19,48.18 IOA.2
GPA2  (via drill 0.41 pad 1.02)
  Top 0.254: IC5.23 72.09,44.06 v70.34,44.06
  Bottom 0.254: IOA.3 78.28,51.36 76.69,51.36 75.74,50.41 75.74,48.5 71.3,44.06 70.82,44.06 v70.34,44.06
GPA3
  Top 0.254: IC5.24 71.97,44.73 71.93,44.69 73.2,44.69 77.33,48.82 78.28,48.82 IOA.4
GPA4
  Top 0.254: IC5.25 70.61,45.38 70.03,45.96 70.03,50.72 70.66,51.36 72.57,51.36 73.2,51.99 73.2,53.27 73.84,53.9 75.74,53.9 IOA.5
GPA5
  Top 0.254: IC5.26 72,46.03 71.93,45.96 73.2,45.96 77.01,49.77 IOA.6
GPA6
  Top 0.254: IC5.27 70.9,46.68 70.66,46.91 70.66,47.87 70.98,48.18 72.57,48.18 73.2,48.82 73.2,50.72 74.47,51.99 IOA.7
GPA7
  Top 0.254: IC5.28 73.3,47.33 74.47,48.5 IOA.8
GPB0
  Top 0.254: IC5.1 64.81,47.73 65.27,48.18 65.27,51.36 IOB.1
GPB1
  Top 0.254: IC5.2 65.98,46.68 67.17,47.87 67.17,49.45 IOB.2
GPB2
  Top 0.254: IC5.3 63.93,46.03 63.36,46.6 63.36,48.82 62.73,49.45 62.73,50.72 64,51.99 IOB.3
GPB3  (via drill 0.41 pad 1.02)
  Top 0.254: IC5.4 64.84,45.41 66.38,45.41 v66.85,45.88
  Bottom 0.254: IOB.4 66.85,47.23 v66.85,45.88
GPB4
  Top 0.254: IC5.5 63.96,44.73 62.73,45.96 62.73,48.18 62.09,48.82 60.82,48.82 60.19,49.45 60.19,51.36 IOB.5
GPB5
  Top 0.254: IC5.6 67.51,44.08 68.12,44.69 68.12,52.95 67.17,53.9 63.36,53.9 62.73,53.27 62.73,51.99 61.46,50.72 IOB.6
GPB7  (via drill 0.41 pad 1.02)
  Top 0.254: 60.82,43.42 63.04,43.42 63.68,42.79 64.81,42.79 IC5.8 | 60.82,43.42 v60.82,46.91 | v61.14,34.53 60.5,35.17 60.5,43.1 60.82,43.42
  Bottom 0.254: v60.82,46.91 58.92,48.82 IOB.8 | DRDY.1 59.11,16.63 60.82,18.34 60.82,34.21 v61.14,34.53
INTA  (via drill 0.41 pad 1.02)
  Top 0.254: IC5.20 v73.52,42.15 | U2.14 45.6,49.48 46.85,50.72 51.93,50.72 52.57,50.09 v52.57,49.45
  Bottom 0.254: v73.52,42.15 71.93,42.15 70.66,40.88 68.76,40.88 64.95,44.69 56.06,44.69 52.57,48.18 v52.57,49.45
INTB  (via drill 0.41 pad 1.02)
  Top 0.254: U2.13 46.25,49.17 47.17,50.09 50.66,50.09 v51.3,49.45 | IC5.19 72.92,41.48 v73.52,40.88
  Bottom 0.254: v73.52,40.88 71.62,40.88 70.66,39.93 68.76,39.93 64.63,44.06 55.74,44.06 51.3,48.5 v51.3,49.45
INTC  (via drill 0.41 pad 1.02)
  Top 0.254: IC2.7 67.49,35.8 66.22,37.07 v65.27,37.07 | OPTION0.6 31.61,44.69 33.52,44.69 34.15,44.06 34.15,42.47 34.79,41.83 37.01,41.83 38.91,39.93 v38.91,38.66 R19.1
  Bottom 0.254: U$3.22 29.07,51.99 29.07,48.5 30.34,47.23 OPTION0.6 | v38.91,38.66 40.5,37.07 54.79,37.07 56.38,38.66 60.5,38.66 62.09,37.07 v65.27,37.07
INTD  (via drill 0.41 pad 1.02)
  Top 0.254: IC1.32 38.6,25.01 38.28,25.32 v36.85,25.32 | v57.33,36.44 57.33,43.74 52.57,48.5 50.66,48.5 49.71,49.45 47.17,49.45 46.9,49.19 U2.12
  Bottom 0.254: v36.85,25.32 37.64,26.12 37.64,31.99 42.09,36.44 v57.33,36.44
J_PI_CE1  (via drill 0.41 pad 1.02)
  Top 0.254: U2.6 44.95,41.84 v44.31,41.2 45.58,39.93 46.85,39.93 47.49,40.56 J_CE1B.1
  Bottom 0.254: J_CE1.3 43.74,41.77 v44.31,41.2
J_PI_INTA  (via drill 0.41 pad 1.02)
  Top 0.254: U2.7 45.6,41.97 v46.22,41.2
  Bottom 0.254: J_CE1.1 46.79,41.83 | 46.79,41.83 46.79,41.77 v46.22,41.2 | J_CE1B.3 51.3,45.64 51.61,45.33 51.61,42.47 50.98,41.83 46.79,41.83
MISO
  Top 0.254: SPI.2 39.23,51.04 39.87,50.41 42.09,50.41 43,49.49 U2.18
MOSI
  Top 0.254: SPI.1 39.55,49.77 41.45,49.77 41.7,49.52 U2.20
N$1
  Top 0.254: Q2.3 37.57,26.03 37.8,25.8 38.91,25.8 39.37,25.34 IC1.31
N$2
  Top 0.254: IC1.30 40.17,24.52 40.18,24.53 40.18,25.48 40.57,25.87 Q2.1
N$3  (via drill 0.41 pad 1.02)
  other vias: 25.58,37.07
N$4  (via drill 0.41 pad 1.02)
  other vias: 15.74,5.64
N$7
  Top 0.254: R11.2 79.39,4.85 79.87,5.32 79.87,8.18 79.42,8.63 R16.1 75.96,8.63 C15.- C14.-
N$8
  Top 0.254: C14.+ INL.1
N$9
  Top 0.406: HP+.1 80.82,19.29 C21.-
N$19  (via drill 0.41 pad 1.02)
  Top 0.254: IC1.38 33.83,19.14 33.36,19.61 v32.25,19.61
  Bottom 0.254: v32.25,19.61 31.45,19.61 30.02,18.18 30.02,17.07 27.8,14.85 27.8,10.4 25.9,8.5 SX.S
N$22  (via drill 0.41 pad 1.02)
  Top 0.254: IC1.17 45.26,18.34 v44.31,17.39
  Bottom 0.254: v44.31,17.39 44.95,16.75 44.95,14.53 PGD.TP
N$23  (via drill 0.41 pad 1.02)
  Top 0.254: IC1.16 46.37,17.54 44.31,15.48 v43.68,15.48
  Bottom 0.254: v43.68,15.48 41.77,15.48 40.82,14.53 PGC.TP
N$24  (via drill 0.41 pad 1.02)
  Top 0.254: v32.25,18.34 IC1.39
  Bottom 0.254: v32.25,18.34 31.29,18.34 30.66,17.7 30.66,16.75 28.44,14.53 SY.S
N$33
  Top 0.254: IC2.1 65.32,27.65 Q6.2
N$34
  Top 0.254: IC2.2 67.49,26.59 66.85,25.96 64.47,25.96 Q6.1
N$36
  Bottom 0.254: IC7.DRY DRDY.2
N$39
  Top 0.254: PWR.A R14.2
N$40
  Top 0.254: C15.+ 75.74,3.42 INR.1
N$41
  Top 0.254: R11.1 80.51,2.15 80.82,2.46 80.82,3.73 81.14,4.05 R15.2 82.25,7.29 | IC6.3 83.05,12.62 83.36,12.31 83.36,9.77 82.25,8.66 82.25,7.29 | 82.25,7.29 R16.2
N$42
  Top 0.406: IC6.5 76.32,15.54 75.11,16.75 73.52,16.75 | 73.52,16.75 R3.2 | C21.+ 73.34,16.93 73.52,16.75
N$43
  Top 0.406: R3.1 C17.1
N$47
  Top 0.254: IC6.7 75.11,11.35 74.79,11.04 74.79,10.72 74.47,10.4 C19.1
N$58
  Top 0.254: IC2.3 68.76,27.55
  Top 0.305: CR1220.+2 69.33,24.91 68.76,25.48 IC2.3
OPTION0
  Top 0.254: OPTION0.1 24.31,43.42 23.97,43.08 U1.14
OPTION1
  Top 0.254: OPTION0.2 25.26,45.33 23.67,43.73 U1.15
OPTION2
  Top 0.254: OPTION0.3 26.53,44.69 26.53,46.6 25.9,47.23 24.63,47.23 23.67,46.28 23.04,46.28 22.44,45.68 U1.18
OPTION3  (via drill 0.41 pad 1.02)
  Top 0.254: OPTION0.4 29.07,44.69 29.07,42.15 30.34,40.88 OPTION1.2 | U1.17 23.33,45.03 v23.36,45.01
  Bottom 0.254: OPTION0.4 26.53,47.23 24.63,47.23 23.36,45.96 v23.36,45.01
OPTION4  (via drill 0.41 pad 1.02)
  Top 0.254: OPTION0.5 32.88,40.88 OPTION1.3 | U1.16 v20.51,44.38 v20.5,44.38
  Bottom 0.254: OPTION0.5 29.39,43.42 29.07,43.74 29.07,44.06 28.44,44.69 24.63,44.69 23.67,43.74 21.13,43.74 v20.5,44.38
PI_CE0
  Top 0.254: U$3.24 31.61,54.53 33.52,54.53 34.15,53.9 34.15,50.09 34.79,49.45 36.69,49.45 38.6,47.55 38.6,46.28 39.55,45.33 43.68,45.33 44.3,44.7 U2.5
PI_CE1
  Bottom 0.254: J_CE1.2 45.26,45.01 45.58,45.33 | 45.58,45.33 45.58,47.87 43.99,49.45 36.06,49.45 32.88,52.63 U$3.26 | 45.58,45.33 46.22,44.69 47.8,44.69 48.12,44.38 49.39,44.38 49.71,44.06 J_CE1B.2
PI_INTB  (via drill 0.41 pad 1.02)
  Top 0.254: U$3.15 21.45,51.99 v31.61,51.99 | v44.31,46.91 44.31,45.64 46.25,43.7 U2.8
  Bottom 0.254: v31.61,51.99 31.61,49.45 32.56,48.5 43.68,48.5 44.31,47.87 v44.31,46.91
PI_INTD  (via drill 0.41 pad 1.02)
  Top 0.254: U2.9 46.9,45.91 v46.85,45.96
  Bottom 0.254: U$3.12 16.37,54.53 33.83,54.53 34.47,53.9 34.47,51.99 36.37,50.09 44.63,50.09 46.85,47.87 v46.85,45.96
PI_MISO
  Top 0.254: U$3.21 27.8,49.77 29.39,48.18 36.06,48.18 37.33,46.91 37.33,45.64 38.91,44.06 42.72,44.06 43,43.78 U2.3
PI_MOSI
  Top 0.254: U$3.19 25.26,50.41 25.9,49.77 26.53,49.77 28.75,47.55 35.74,47.55 36.69,46.6 36.69,45.33 39.29,42.73 U2.1
PI_OPTION0
  Top 0.254: U$3.7 10.02,49.77 14.47,45.33 14.47,43.42 14.81,43.08 U1.7
PI_OPTION1
  Top 0.254: U$3.11 13.51,49.14 13.51,47.23 15.1,45.64 15.1,44.06 15.43,43.73 U1.6
PI_OPTION2
  Top 0.254: U$3.13 17.64,49.77 17.01,49.14 17.01,45.96 16.73,45.68 U1.3
PI_OPTION3
  Top 0.254: U$3.16 18.91,51.99 18.91,49.77 17.64,48.5 17.64,45.64 17.03,45.03 U1.4
PI_OPTION4  (via drill 0.41 pad 1.02)
  Top 0.254: v17.48,42.63 17.48,44.06 17.16,44.38 U1.5
  Bottom 0.254: U$3.18 21.45,51.99 19.55,51.99 18.91,51.36 18.91,49.77 17.48,48.34 v17.48,42.63
PI_SCL
  Top 0.254: U$3.5 8.43,49.77 9.07,49.77 13.83,45.01 13.83,42.79 14.19,42.43 U1.8
PI_SCLK
  Top 0.254: U$3.23 30.34,49.77 31.29,48.82 36.37,48.82 37.96,47.23 37.96,45.96 39.23,44.69 43.36,44.69 43.65,44.4 U2.4
PI_SDA
  Top 0.254: U$3.3 6.53,49.14 8.75,49.14 13.2,44.69 13.2,42.47 13.88,41.78 U1.9
RC1
  Top 0.254: IC1.35 34.65,21.54 RC1.TP
RC2
  Top 0.254: IC1.36 34.65,20.74 RC2.TP
RC5
  Top 0.254: IC1.43 34.65,15.14 RC5.TP
RX_PI  (via drill 0.41 pad 1.02)
  Top 0.254: v25.26,32.63 24.31,31.67 R10.2 R9.1 24.31,27.55 23.99,27.23 23.99,26.45 D2.3
  Bottom 0.254: U$3.10 11.29,51.99 11.29,49.77 14.15,46.91 14.15,41.83 20.5,35.48 22.72,35.48 25.26,32.95 v25.26,32.63
RX_PIC  (via drill 0.41 pad 1.02)
  Top 0.254: IC1.1 37.41,12.54 36.37,13.58 31.93,13.58 29.23,16.28 29.23,26.75 v28.44,27.55 | U1.20 20.25,46.98 v20.18,46.91
  Bottom 0.254: v28.44,27.55 26.53,29.45 26.53,33.26 23.36,36.44 20.82,36.44 19.07,38.18 19.07,42.79 18.43,43.42 18.43,46.12 19.23,46.91 v20.18,46.91
SCL  (via drill 0.41 pad 1.02)
  Top 0.254: IC5.12 66.22,40.17 66.3,40.17 67.17,39.29 67.17,37.39 v68.76,35.8 IC2.6 | v25.58,41.2 24.35,42.43 U1.13 | IC1.37 34.14,19.94 33.52,20.56 33.52,30.09 v37.64,34.21
  Bottom 0.254: IC7.SCL 64.63,20.24 65.27,20.88 65.27,25.96 68.76,29.45 v68.76,35.8 66.22,38.34 64.63,38.34 64,37.71 62.41,37.71 60.82,39.29 56.06,39.29 54.47,37.71 41.14,37.71 38.91,39.93 37.96,39.93 | OPTION0.7 32.88,42.15 | 32.88,42.15 33.83,41.2 36.69,41.2 37.96,39.93 | 32.88,42.15 31.93,41.2 v25.58,41.2 | v37.64,34.21 37.64,39.61 37.96,39.93
SCLK
  Top 0.254: SPI.3 41.77,51.68 43.65,49.79 U2.17
SDA  (via drill 0.41 pad 1.02)
  Top 0.254: U1.12 23.09,41.78 v23.67,41.2 | IC5.13 63.6,39.53 v63.36,39.29 | v70.03,37.07 IC2.5 | IC1.42 34.29,15.94 33.52,15.16 32.25,15.16 30.98,16.43 30.98,20.24 32.88,22.15 32.88,30.4 36.06,33.58 v36.06,34.21
  Bottom 0.254: IC7.SDA 64.63,17.7 66.22,19.29 66.22,25.64 70.03,29.45 v70.03,37.07 69.08,37.07 66.85,39.29 v63.36,39.29 62.73,39.93 55.74,39.93 54.15,38.34 41.45,38.34 39.23,40.56 38.28,40.56 37.01,41.83 34.79,41.83 34.15,42.47 34.15,44.06 33.52,44.69 32.88,44.69 | OPTION0.8 32.88,44.69 | 32.88,44.69 32.25,44.69 31.61,44.06 31.61,42.79 30.98,42.15 24.63,42.15 v23.67,41.2 24.63,40.25 26.21,40.25 26.53,40.56 36.06,40.56 37.01,39.61 37.01,37.71 36.06,36.75 v36.06,34.21
SS0  (via drill 0.41 pad 1.02)
  Top 0.254: IC1.40 32.72,17.54 v32.25,17.07
  Bottom 0.254: S0.S 33.52,8.5 32.25,9.77 v32.25,17.07
SS1  (via drill 0.41 pad 1.02)
  Top 0.254: v33.52,16.43 33.83,16.75 35.96,16.75 IC1.41
  Bottom 0.254: v33.52,16.43 33.52,9.77 34.47,8.81 35.42,8.81 36.06,8.18 S1.S
SS2
  Top 0.254: IC1.2 38.57,6.93 S2.S
SS3
  Top 0.254: IC1.3 39.37,10.26 41.14,8.5 S3.S
SS4
  Top 0.254: IC1.4 40.17,10.41 S4.S
SS5
  Top 0.254: IC1.5 40.97,11.2 43.83,8.34 44.79,8.34 S5.S
SS6
  Top 0.254: IC1.8 43.37,12.32 | 43.37,12.32 43.36,12.31 | 43.37,12.32 43.37,11.34 45.26,9.45 50.34,9.45 51.3,8.5 S6.S
SS7
  Top 0.254: IC1.9 44.17,11.49 45.58,10.08 52.88,10.08 53.84,9.13 S7.S
SS8
  Top 0.254: IC1.10 44.97,11.65 45.9,10.72 53.2,10.72 55.11,8.81 55.74,8.81 56.38,8.18 S8.S
SS9
  Top 0.254: IC1.11 45.77,11.8 46.22,11.35 53.52,11.35 55.42,9.45 58.28,9.45 58.92,8.81 S9.S
SS10
  Top 0.254: IC1.14 48.62,15.94 49.07,15.48 49.07,12.62 49.71,11.99 53.84,11.99 55.74,10.08 60.19,10.08 61.46,8.81 S10.S
SS11
  Top 0.254: IC1.15 48.77,16.74 49.71,15.8 49.71,12.94 50.03,12.62 54.15,12.62 56.06,10.72 60.82,10.72 62.09,9.45 63.36,9.45 64,8.81 S11.S
TX_PI
  Top 0.254: U$3.8 11.29,51.99 15.74,51.99 16.37,51.36 16.37,49.77 16.05,49.45 16.05,46.98 U1.1
TX_PIC
  Top 0.254: IC1.44 32.12,14.34 29.86,16.59 29.86,28.18 29.23,28.82 R9.2
UC_RESET  (via drill 0.41 pad 1.02)  (1 unrouted)
  Top 0.254: IC1.18 45.73,19.14 v45.42,19.45 | v50.98,15.16 50.98,14.21 51.3,13.89 R4.1 | IOB.7 57.65,51.36 57.65,49.45 58.92,48.18 61.46,48.18 62.09,47.55 62.09,45.33 63.99,43.43 IC5.7
  Bottom 0.254: v45.42,19.45 45.42,18.5 RST.TP v50.98,15.16
VDD  (via drill 0.41 pad 1.02)
  Top 0.254: R1.2 19.55,25.96 18.91,25.32 v18.91,24.05
  Bottom 0.254: BATT.1 J_BATT0.2 2.91,21.7 3.67,22.47 J_BATT1.2 4.62,20.88 5.26,20.24 8.75,20.24 12.56,24.05 v18.91,24.05
VEE
  Top 0.254: IC3.6 10.97,2.15
  Top 1.422: RSENSE.2 4.75,2.65 5.26,2.15 10.97,2.15 17.96,2.15 18.91,3.1 20.36,3.1 | S3.+ S2.+ S1.+ S0.+ SY.+ SX.+ 23.36,4.37 22.09,3.1 20.36,3.1 | S3.+ S4.+ S5.+ | S11.+ S10.+ S9.+ S8.+ S7.+ S6.+ S5.+ | S3.+ S5.+ | 20.36,3.1 C9.+
VSS  (via drill 0.41 pad 1.02, 3.2 pad 6.3)  (1 unrouted)
  Top 0.254: 41.77,15.01 IC1.6 41.77,11.35 44.31,8.81 45.26,8.81 45.58,8.5 47.8,8.5 48.44,7.86 | 36.37,23.74 38.6,21.51 39.55,21.51 40.98,22.94 IC1.29 | IC5.16 IC5.17 68.51,40.18 67.17,41.52 64.85,41.52 IC5.10 63.64,41.48 63.04,40.88 63.04,40.56 61.93,40.56 C6.1 | U2.11 47.74,48.56 47.8,48.5 | U1.11 21.83,40.62 21.45,40.56 | R16.3 78.5,5.54 77.65,4.69 77.97,4.37
  Top 0.406: U$3.6 6.21,53.27 6.21,55.17 | 30.34,55.17 34.47,55.17
  Top 0.813: 72.57,22.47 72.57,23.74
  Top 1.676: 23.99,1.83 S5.- 43.99,1.83 | S11.- 50.98,1.83
  Bottom 0.254: 57.65,48.5 57.65,50.72 58.28,51.36 59.55,51.36 60.19,50.72 60.19,48.5 | 73.2,48.82 73.2,50.72 73.84,51.36 75.11,51.36 75.74,51.99 75.74,54.53
  Bottom 0.406: 8.75,49.45 8.75,53.27 | 8.75,54.22 8.75,53.27 | 8.75,53.27 U$3.6
  other vias: 80.19,43.42 25.42,18.02 67.81,24.37 62.73,25.64 48.76,6.91 38.91,16.75 44.79,21.36 63.36,35.17
  pour Top (isolate 0.381): 0.5,55.49 84.31,55.49 84.31,23.42 67.81,23.42 67.81,0.56 0.5,0.56
  pour Bottom (isolate 0.381): 0.5,55.49 84.31,55.49 84.31,23.42 67.81,23.42 67.81,0.56 0.5,0.56
  pour Top (isolate 0.457): 68.44,0.56 84.31,0.56 84.31,22.78 68.44,22.78
  pour Bottom (isolate 0.457): 68.44,0.56 84.31,0.56 84.31,22.78 68.44,22.78

### Text on the board
tNames: INTA | CE1 | 3.3V | Logic / pwr 5V | 5V | Gnd | BleuettePi | Rev. 1.x.x | VBATT | Servo / pwr ~6V | AUDIO | J_BATT | HP | Battery / sense | GND | GY-27 | L | GND | R
bNames: MISO | CE0 | GND | IOB | IOA | MOSI | SCLK | CE1 | 5V | J_BATT | CE1 | INTA | Logic / pwr 5V | BleuettePi | Gnd | AN | hugo, 04/2013 | Servo / pwr ~6V | AUDIO / OUT | AUDIO IN